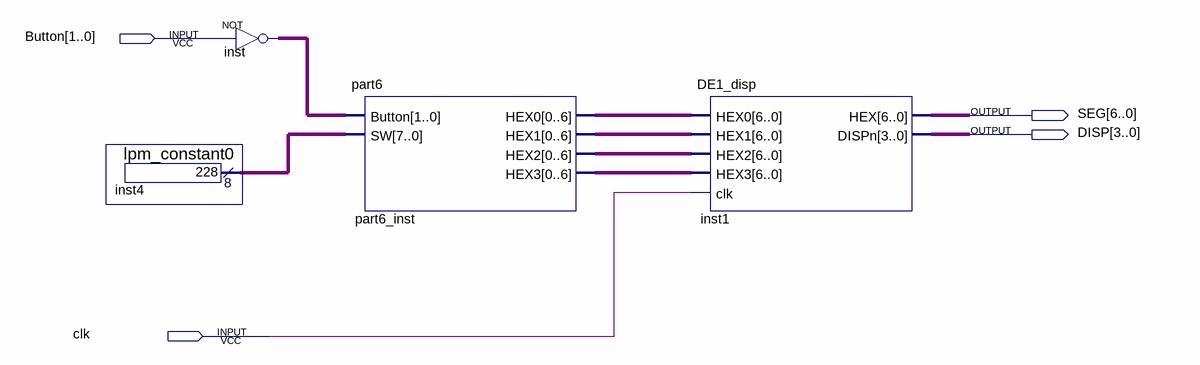
[diagram p0: schematic sheet]
// Quartus schematic part6_top.bdf as structural Verilog: 4 symbols, 4 pins
module part6_top (
  input  [1:0] Button,
  input  clk,
  output [6:0] SEG,
  output [3:0] DISP
);

  wire [1:0] inst_out;
  wire [6:0] part6_inst_hex0, part6_inst_hex1, part6_inst_hex2, part6_inst_hex3;
  wire [7:0] inst4_result;

  lpm_constant0 inst4 (.result(inst4_result));
  assign inst_out = ~Button;  // NOT inst, 2 bits wide
  part6 part6_inst (
    .Button(inst_out), .SW(inst4_result), .HEX0(part6_inst_hex0), .HEX1(part6_inst_hex1),
    .HEX2(part6_inst_hex2), .HEX3(part6_inst_hex3));
  DE1_disp inst1 (
    .HEX0(part6_inst_hex0), .HEX1(part6_inst_hex1), .HEX2(part6_inst_hex2), .HEX3(part6_inst_hex3),
    .clk(clk), .HEX(SEG), .DISPn(DISP));
endmodule
